# Altium schematic sheet 24V.SchDoc
size A4; SheetNumber: 1; SheetTotal: 5
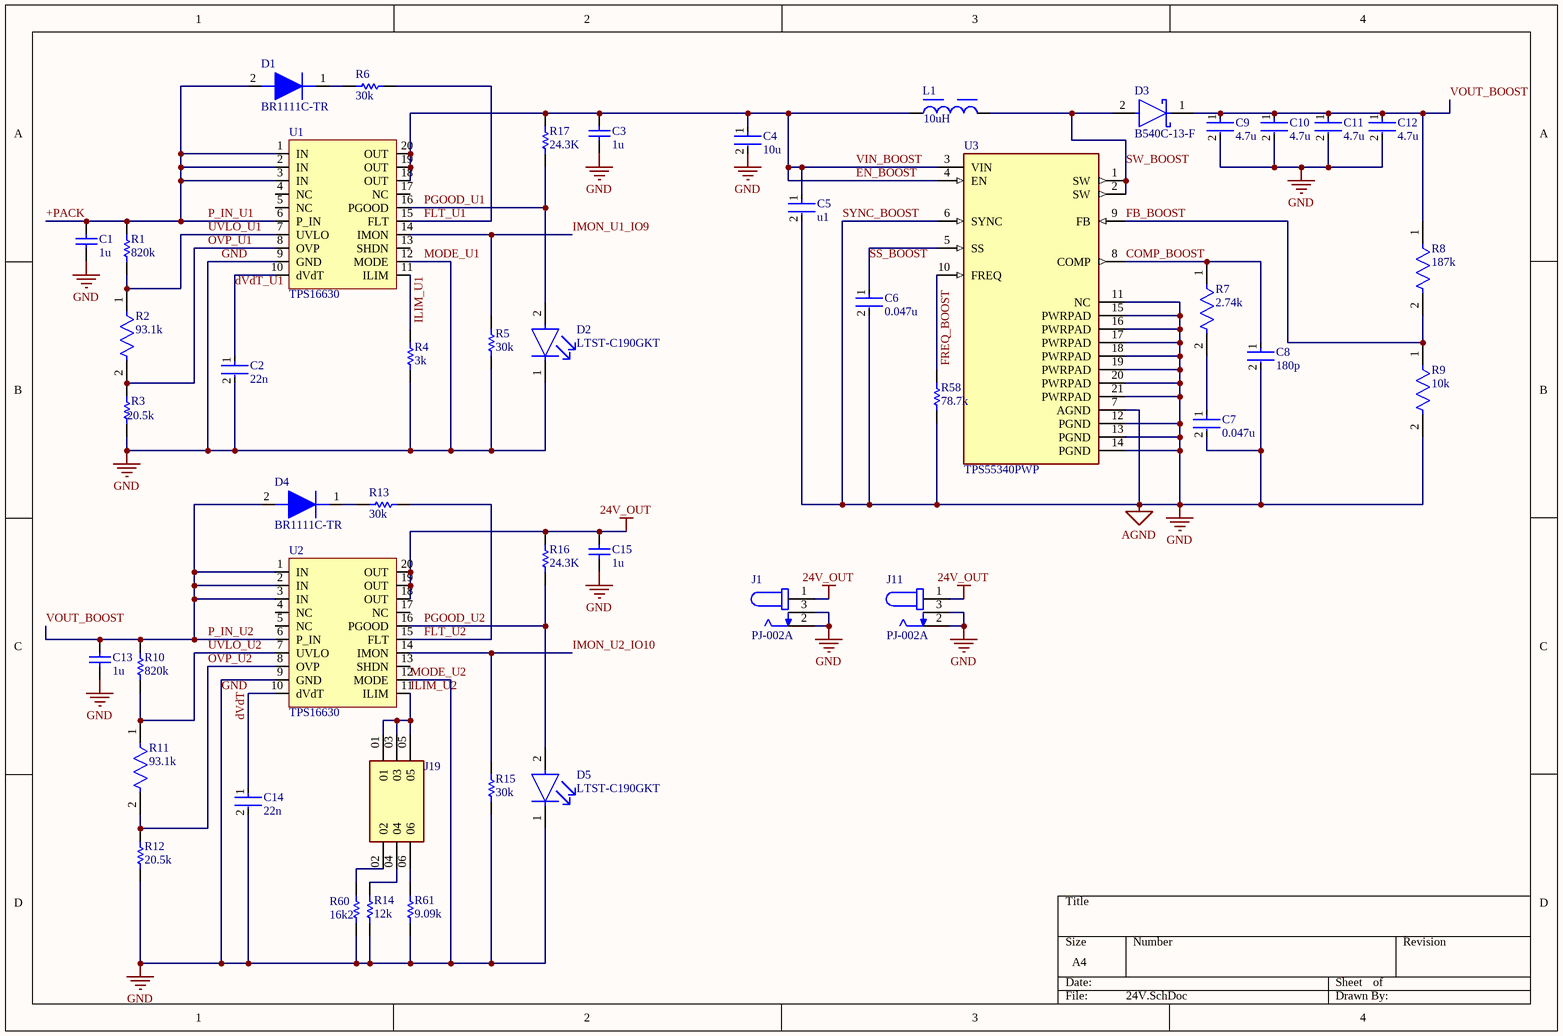
[diagram p0: 24V.SchDoc]

## Parts
C1  1u  [CAPC2013X140X50ML20T25]
C2  22n  [FP-C0603C-CF-MFG]
C3  1u  [CAPC2013X140X50ML20T25]
C4  10u  [FP-GRM21B-0_2-e0_2_0_7-MFG]
C5  u1  [FP-CC0805-0_85-MFG]
C6  0.047u  [FP-C0805C-DN-MFG]
C7  0.047u  [FP-C0805C-DN-MFG]
C8  180p  [FP-C0805C-DN-MFG]
C9  4.7u  [FP-GRM32-MFG]
C10  4.7u  [FP-GRM32-MFG]
C11  4.7u  [FP-GRM32-MFG]
C12  4.7u  [FP-GRM32-MFG]
C13  1u  [CAPC2013X140X50ML20T25]
C14  22n  [FP-C0603C-CF-MFG]
C15  1u  [CAPC2013X140X50ML20T25]
D1  BR1111C-TR  [LED_APHD1608LVBC/D]
D2  LTST-C190GKT  [FP-LTST-C190GKT-MFG]
D3  B540C-13-F  [FP-SMC-MFG]
D4  BR1111C-TR  [LED_APHD1608LVBC/D]
D5  LTST-C190GKT  [FP-LTST-C190GKT-MFG]
J1  PJ-002A  [CUI_PJ-002A]
J11  PJ-002A  [CUI_PJ-002A]
J19  MTSW-103-10-T-D-470  [SAMTEC_MTSW-103-10-T-D-470]  (value not drawn)
L1  10uH  [WE-LHMI_1040]
R1  820k  [RESC1608X55X30ML15T15]
R2  93.1k  [FP-CR0805-IPC_B]
R3  20.5k  [RESC2013X60X40LL20T25]
R4  3k  [RESC2013X70X40NL20T20]
R5  30k  [RESC1609X50X30ML10T20]
R6  30k  [RESC1609X50X30ML10T20]
R7  2.74k  [FP-CR0805-IPC_A]
R8  187k  [FP-ERJ3EK-MFG]
R9  10k  [FP-ERA3A-IPC_C]
R10  820k  [RESC1608X55X30ML15T15]
R11  93.1k  [FP-CR0805-IPC_B]
R12  20.5k  [RESC2013X60X40LL20T25]
R13  30k  [RESC1609X50X30ML10T20]
R14  12k  [RESC2013X70X40ML20T20]
R15  30k  [RESC1609X50X30ML10T20]
R16  24.3K  [RESC1609X50X30NL10T20]
R17  24.3K  [RESC1609X50X30NL10T20]
R58  78.7k  [RESC1608X55X30ML15T15]
R60  16k2  [RESC2013X50X30NL20T20]
R61  9.09k  [RESC2013X60X35ML10T20]
U1  TPS16630  [SOP65P640X110-21N]
U2  TPS16630  [SOP65P640X110-21N]
U3  TPS55340PWP  [IC_TPS55340PWP]

## Nets
24V_OUT: C15.2 J1.1 J11.1 R16.2 U2.18(OUT) U2.19(OUT) U2.20(OUT)
GND: C1.1 C2.2 C3.1 C4.2 C5.2 C6.2 C7.2 C8.2 C9.2 C10.2 C11.2 C12.2 C13.1 C14.2 C15.1 D2.1(C) D5.1(C) J1.2 J1.3 J11.2 J11.3 R3.1 R4.1 R5.1 R9.2 R12.1 R14.1 R15.1 R58.1 R60.1 R61.1 U1.9(GND) U1.12(MODE) U2.9(GND) U2.12(MODE) U3.6(SYNC) U3.7(AGND) U3.11(NC) U3.12(PGND) U3.13(PGND) U3.14(PGND) U3.15(PWRPAD) U3.16(PWRPAD) U3.17(PWRPAD) U3.18(PWRPAD) U3.19(PWRPAD) U3.20(PWRPAD) U3.21(PWRPAD)  [also labelled AGND, MODE_U1, MODE_U2, SYNC_BOOST]
+PACK: C1.2 D1.2 R1.2 U1.1(IN) U1.2(IN) U1.3(IN) U1.6(P_IN)  [also labelled P_IN_U1]
COMP_BOOST: C8.1 R7.1 U3.8(COMP)
dVdT: C14.1 U2.10(dVdT)
dVdT_U1: C2.1 U1.10(dVdT)
EN_BOOST: C3.2 C4.1 C5.1 L1.1 R17.2 U1.18(OUT) U1.19(OUT) U1.20(OUT) U3.3(VIN) U3.4(EN)  [also labelled VIN_BOOST]
FB_BOOST: R8.2 R9.1 U3.9(FB)
FLT_U1: R6.1 U1.15(FLT)
FLT_U2: R13.2 U2.15(FLT)
FREQ_BOOST: R58.2 U3.10(FREQ)
ILIM_U1: R4.2 U1.11(ILIM)
ILIM_U2: J19.01 J19.03 J19.05 U2.11(ILIM)
IMON_U1_IO9: R5.2 U1.14(IMON)
IMON_U2_IO10: R15.2 U2.14(IMON)
OVP_U1: R2.2 R3.2 U1.8(OVP)
OVP_U2: R11.2 R12.2 U2.8(OVP)
P_IN_U2: C9.1 C10.1 C11.1 C12.1 C13.2 D3.1(C) D4.2 R8.1 R10.2 U2.1(IN) U2.2(IN) U2.3(IN) U2.6(P_IN)  [also labelled VOUT_BOOST]
PGOOD_U1: D2.2(A) R17.1 U1.16(PGOOD)
PGOOD_U2: D5.2(A) R16.1 U2.16(PGOOD)
SS_BOOST: C6.1 U3.5(SS)
SW_BOOST: D3.2(A) L1.2 U3.1(SW) U3.2(SW)
UVLO_U1: R1.1 R2.1 U1.7(UVLO)
UVLO_U2: R10.1 R11.1 U2.7(UVLO)
NetC7_1: C7.1 R7.2
NetD1_1: D1.1 R6.2
NetD4_1: D4.1 R13.1
NetJ19_02: J19.02 R60.2
NetJ19_04: J19.04 R14.2
NetJ19_06: J19.06 R61.2

Not connected (* = marked no-connect by the designer): U1 4(NC) 5(NC) 13(SHDN) 17(NC); U2 4(NC) 5(NC) 13(SHDN) 17(NC)

## Library data of the parts
C1 C3 C13 C15 = CMP-2007-03236-1: Manufacturer: Kemet; Part Number: C0805C105K5RACTU
C2 C14 = CMP-2006-03139-2: Ceramic Capacitor 0.022Uf 16V, X7R, 10%, 0603, Full Reel; Manufacturer Part Number: C0603C223K4RACTU; Manufacturer: KEMET; Capacitance: 22,000 pF; Temperature Coefficient: 30ppm/°C; Automotive Grade: Grade 1; Value: 22,000 pF; Tolerance: 0.1; Category: Cap; RoHS: TRUE; Temperature Range High: +125°C; Octopart: https://octopart.com/c0603c223k4ractu-kemet-123286; Mouser Description: CAP CER 0.022UF 16V X7R 0603; Voltage Rating: 16 V; Device Class L1: Passive Components; Automotive: Yes; Height: 0.87mm; Device Class L3: Ceramic Capacitors; Package: C0603C-CF; Temperature Characteristic: X7R; Device Class L2: Capacitors; Material: Ceramic; Lead Free: Yes; ComponentLink2URL: https://api.kemet.com/component-edge/download/datasheet/C0603C100J5GACAUTO.pdf; Temperature Range Low: -55°C; Digikey Description: Ceramic Capacitor 0.022Uf 16V, X7R, 10%, 0603, Full Reel; Temperature: -55°C to +125°C; ComponentLink2Description: Datasheet
C4 = CMP-06035-044754-1: GRM21BR61H106ME43L                       Chip Multilayer Ceramic Capacitors for General Purpose, 0805, 10uF, X5R, 15%, 20%, 50V
C5 = CMP-2100-03606-3: CC0805KRX7R9BB104 CAP CER 0.1UF 50V X7R 0805; Manufacturer: Yageo; Tolerance: 0.1; Capacitance: 100 nF; Value: 100 nF; Material: Ceramic; Device Class L1: Passive Components; ComponentLink2Description: Datasheet; Package: CC0805-0.85; Manufacturer Part Number: CC0805KRX7R9BB104; Digikey Description: CAP CER 0.1UF 50V X7R 0805; Device Class L3: Ceramic Capacitors; Temperature: -30°C to +85°C; Temperature Characteristic: X7R; Voltage Rating: 50 V; Height: 0.95mm; RoHS: TRUE; Ipc Land Pattern Name: CAPC200125X85; Device Class L2: Capacitors; Category: Cap; Temperature Range Low: -30°C; Temperature Range High: +85°C; Mouser Description: Multilayer Ceramic Capacitors MLCC - SMD/SMT 100nF 50V X7R 10%; Footprint Url: http://www.yageo.com/exep/pages/download/literatures/UPY-C_GEN_24.pdf; Automotive: No; Octopart: https://octopart.com/cc0805krx7r9bb104-yageo-192993; Lead Free: Yes; ComponentLink2URL: http://www.yageo.com/documents/recent/UPY-GPHC_Y5V_6.3V-to-50V_8.pdf
C6 C7 = CMP-2007-01098-2: C0805C473K5RACTU  CAP CER 0.047UF 50V X7R 0805; Manufacturer: KEMET; Value: 47,000 pF; Material: Ceramic; Tolerance: 0.1; Description: C0805 47,000 pF X7R 30ppm/°C 10.00% 50 V; Temperature Coefficient: 30ppm/°C; Ipc Land Pattern Name: CAPC200125X78; ComponentLink2URL: https://content.kemet.com/datasheets/KEM_C1003_C0G_SMD.pdf; Manufacturer Part Number: C0805C473K5RACTU; ComponentLink2Description: Datasheet; Voltage Rating: 50 V; Device Class L3: Ceramic Capacitors; Temperature Range High: +125°C; Temperature: -55°C to +125°C; RoHS: TRUE; Capacitance: 47,000 pF; Digikey Description: CAP CER 0.047UF 50V X7R 0805; Octopart: https://octopart.com/c0805c473k5ractu-kemet-138387; Temperature Range Low: -55°C; Height: 0.88mm; Lead Free: Yes; Temperature Characteristic: X7R; Mouser Description: Capacitor; Ceramic; Cap 0.047 uF; Tol 10%; Vol-Rtg 50 VDC; SMT; 0805; X7R; Tape&Reel; Automotive: No; Device Class L1: Passive Components; Device Class L2: Capacitors; Package: C0805C-DN; Category: Cap
C8 = CMP-2007-00307-2: CAP CER 180PF 50V C0G/NP0 0805; Manufacturer: KEMET; Manufacturer Part Number: C0805C181J5GACTU; Temperature Characteristic: C0G; Temperature Coefficient: 30ppm/°C; Tolerance: 0.05; Material: Ceramic; ComponentLink2Description: Datasheet; Automotive: No; Value: 180 pF; Temperature Range High: +125°C; Digikey Description: CAP CER 180PF 50V C0G/NP0 0805; Octopart: https://octopart.com/c0805c181j5gactu-kemet-108653; Device Class L2: Capacitors; ComponentLink2URL: https://content.kemet.com/datasheets/KEM_C1003_C0G_SMD.pdf; RoHS: TRUE; Device Class L3: Ceramic Capacitors; Voltage Rating: 50 V; Lead Free: Yes; Package: C0805C-DN; Temperature Range Low: -55°C; Capacitance: 180 pF; Ipc Land Pattern Name: CAPC200125X78; Mouser Description: Multilayer Ceramic Capacitors MLCC - SMD/SMT 50volts 180pF C0G 5%; Temperature: -55°C to +125°C; Category: Cap; Height: 0.88mm; Device Class L1: Passive Components
C9-C12 = CMP-1038-02162-3: CAP CER 4.7UF 50V X7R 1210; Manufacturer: Murata; Manufacturer Part Number: GRM32ER71H475KA88L; Tolerance: 10%; Temperature Coefficient: 15%; Material: Ceramic; Lead Free: Yes; Value: 4.7uF; ComponentLink2Description: Datasheet; Capacitance: 4.7uF; Digikey Description: CAP CER 4.7UF 50V X7R 1210; Category: Cap; Automotive: No; ComponentLink2URL: https://search.murata.co.jp/Ceramy/image/img/A01X/G101/ENG/GRM32ER71H475KA88-01A.pdf; Package: GRM32; Device Class L2: Capacitors; Voltage Rating: 50V; Device Class L1: Passive Components; Mouser Description: Capacitor Capacitance tolerance: ±10% Ceramic type: X7R Construction form: 1210 Capacitance: 4.7 µF Rated voltage: 50...; Octopart: https://octopart.com/grm32er71h475ka88l-murata-196576; Temperature: -55°C to +125°C; Temperature Range Low: -55°C; Height: 2.7mm; Temperature Characteristic: X7R; Temperature Range High: +125°C; RoHS: TRUE; Device Class L3: Ceramic Capacitors
D2 D5 = CMP-22017-000005-2: LED GREEN CLEAR CHIP SMD; Dominant Wavelength: 569nm; Reverse Voltage: 5V; Lens Color: Colorless; Viewing Angle: 130°; Voltage: 2V; Forward Current: 30mA; Power Dissipation: 100mW; Luminous Intensity: 6mcd; Number of LEDs: 1; Forward Voltage: 2.1V; Wavelength: 565nm; Test Current: 10mA; Min Operating Temperature: -55°C; Lens Style: Clear; Mount: Surface Mount; Width: 0.8mm; Packaging: Tape and Reel; Lens Transparency: Clear; Case Code (Metric): 1608; Depth: 0.8mm; Case Code (Imperial): 0603; Case/Package: 0603; Number of Pins: 2; Max Operating Temperature: 85°C; Lead Free: Lead Free; Number of Elements: 1; Length: 1.6mm; Height: 0.8mm; Package Quantity: 1; Power Rating: 100mW; Radiation Hardening: No; Illumination Color: Green; Color: Green
D3 = CMP-2000-05097-3: DIODE SCHOTTKY 40V 5A SMC; Manufacturer: Diodes Inc.; Automotive Grade: NA; Peak Reverse Current: 0.5mA; Value: 300pF; Max Junction Temp: +150°C; Max Surge Forward Current: 100A; Standoff Height: 0.1mm; Digikey Description: DIODE SCHOTTKY 40V 5A SMC; Temperature Range Low: -55°C; Manufacturer Part Number: B540C-13-F; Octopart: https://octopart.com/b540c-13-f-diodes+inc.-325873; Lead Free: Yes; Reverse Voltage: 40V; RoHS: TRUE; Category: Diode; Mouser Description: Diode: Schottky rectifying; SMD; 40V; 5A; SMC; Package: reel, tape; ComponentLink2Description: Datasheet; Temperature Range High: +150°C; Automotive: No; Footprint Url: https://www.diodes.com/assets/Package-Files/SMC.pdf; Device Class L3: Schottky Diodes; Height: 2.5mm; Forward Current: 5A; Temperature: -55°C to +150°C; Package: SMC; ComponentLink2URL: https://www.diodes.com/assets/Datasheets/ds13012.pdf; Device Class L2: Diodes; Max Repetitive Reverse Voltage: 40V; Device Class L1: Discrete Semiconductors; Capacitance: 300pF
J1 J11 = PJ-002A: 2.0 x 6.5 mm, 2.5 A, Horizontal, Through Hole, Dc Power Jack Connector; MF: CUI Devices; MP: PJ-002A; Check_prices: https://www.snapeda.com/parts/PJ-002A/CUI+Devices/view-part/?ref=eda; Availability: In Stock; CUI_purchase_URL: https://www.cuidevices.com/product/interconnect/connectors/dc-power-connectors/jacks/pj-002a?utm_source=snapeda.com&utm_medium=referral&utm_campaign=snapedaBOM; SnapEDA_Link: https://www.snapeda.com/parts/PJ-002A/CUI+Devices/view-part/?ref=snap; Purchase-URL: https://pricing.snapeda.com/search/part/PJ-002A/?ref=eda; Price: None; Package: None; Value: *
L1 = CMP-1353-00006-5: NexarPartId: 22866671; Core Material: Composite, Ferrite; Series Resistance: 30mΩ; Test Frequency: 100kHz; Self Resonant Frequency: 12MHz; Max DC Current: 5.2A; Inductance Tolerance: 20%; Inductance: 10µH; Shielding: Shielded; DC Resistance (DCR): 27mΩ; Saturation Current: 7.9A; Width: 10mm; Min Operating Temperature: -40°C; Height: 3.8mm; RoHS: Compliant; Depth: 10mm; Mount: Surface Mount; Case/Package: Nonstandard; Height - Seated (Max): 3.9878mm; Packaging: Digi-Reel®; Tolerance: 20%; REACH SVHC: Unknown; Max Operating Temperature: 125°C; Ambient Temperature Range Low: -40°C; Ambient Temperature Range High: 85°C; Length: 11mm; Composition: Wirewound; Termination: SMD/SMT; RMS Current (Irms): 5.2A; Current Rating: 5.2A; Frequency: 12MHz
R1 R10 = CMP-2000-00657-1: Manufacturer: Panasonic; Part Number: ERJ3EKF8203V
R2 R11 = CMP-07231-005357-1: Thick Film Chip Resistors 0805 93.1kΩ 0.125W 1% 100ppm/°C; Resistance: 93.1kR; Voltage Rating: 150V; Power Rating: 125mW; Number of Terminations: 2; Max Operating Temperature: 155°C; Tolerance: 1%; Width: 0.049inch; Termination: SMD/SMT; Case Code (Imperial): 0805; Mount: Surface Mount; Depth: 1.25mm; Case Code (Metric): 2012; Package Quantity: 5000; Case/Package: 0805; Composition: Thick Film; Thickness: 508um; Military Standard: Not; Contact Plating: Tin; Temperature Coefficient: 100ppm/°C; Features: Moisture Resistant; Height: 0.024inch; Length: 2mm; Min Operating Temperature: -55°C; Radiation Hardening: No; Max Power Dissipation: 125mW; Packaging: Tape and Reel
R3 R12 = CMP-2001-00767-1: Manufacturer: Panasonic; Part Number: ERA6AEB2052V
R4 = CMP-2001-00395-1: ERJ-6GEYJ302V; Manufacturer: Panasonic; Part Number: ERJ-6GEYJ302V
R5 R6 R13 R15 = CMP-2000-03224-1: Manufacturer: Vishay Dale; Part Number: CRCW060330K0JNEA
R7 = CMP-07231-003311-1: Thick Film Chip Resistors 0805 2.74kΩ 0.125W 1% 100ppm/°C; Voltage Rating: 150V; Power Rating: 125mW; Resistance: 2.74kR; Case/Package: 0805; Package Quantity: 5000; Tolerance: 1%; Thickness: 508um; Mount: Surface Mount; Width: 1.25mm; Depth: 1.25mm; Radiation Hardening: No; Case Code (Metric): 2012; Termination: SMD/SMT; Composition: Thick Film; Length: 2mm; Temperature Coefficient: 100ppm/°C; Contact Plating: Tin; Case Code (Imperial): 0805; Features: Moisture Resistant; Height: 0.024inch; Min Operating Temperature: -55°C; Packaging: Tape and Reel; Max Operating Temperature: 155°C; Military Standard: Not; Max Power Dissipation: 125mW; Number of Terminations: 2
R8 = CMP-2000-00305-2: RES SMD 187K OHM 1% 1/10W 0603; Temperature Coefficient: 100ppm/°C; Max Power Dissipation: 100mW; Voltage Rating (DC): 50V; Resistance: 187kR; Voltage Rating: 75V; Packaging: Tape and Reel; Height: 0.45mm; Mount: Surface Mount; Min Operating Temperature: -55°C; Contact Plating: Tin; Radiation Hardening: No; Case/Package: 0603; Technology: THICK FILM; Resistor Type: Thick Film; Features: Automotive AEC-Q200; Length: 1.6mm; REACH SVHC: Yes; Construction: Rectangular; Max Operating Temperature: 155°C; Military Standard: Not; Case Code (Imperial): 0603; RoHS Compliant: Yes; Package Quantity: 1; Power Rating: 100mW; Termination: SMD/SMT; Resistance Tolerance: 1%; Number of Terminations: 2; Case Code (Metric): 1608; Depth: 0.8mm; Series: ERJ; Tolerance: 1%; Width: 0.8mm; Lead Free: Lead Free
R9 = CMP-2000-00874-2: RES SMD 10K OHM 0.1% 1/10W 0603; Voltage Rating (DC): 75V; Power Rating: 100mW; Resistance: 10kR; Temperature Coefficient: 25ppm/°C; Radiation Hardening: No; Width: 0.8mm; Depth: 0.8mm; Construction: Rectangular; Case Code (Metric): 1608; Package Quantity: 5000; Length: 1.6mm; Size Code: 0603; Case Code (Imperial): 0603; Termination: SMD/SMT; Contact Plating: Tin; Resistance Tolerance: 0.1%; Military Standard: Not; Packaging: Tape and Reel; Max Power Dissipation: 100mW; REACH SVHC: No SVHC; Series: ERA-3A; Voltage Rating: 75V; Lead Free: Lead Free; Technology: METAL FILM; RoHS Compliant: Yes; Max Operating Temperature: 155°C; Resistor Type: Thin Film; Min Operating Temperature: -55°C; Number of Pins: 2; Case/Package: 0603; Tolerance: 0.1%; Height: 0.45mm; Mount: Surface Mount; Number of Terminations: 2
R14 = CMP-2001-00513-1: Manufacturer: Panasonic; Part Number: ERJ6ENF1202V
R16 R17 = CMP-2000-03120-1: Part Number: CRCW060324K3FKEA; Manufacturer: Vishay Dale
R58 = CMP-2000-00646-1: Part Number: ERJ-3EKF7872V; Manufacturer: Panasonic
R60 = CMP-1013-00645-2: CRCW080516K2FKEA; Manufacturer: Vishay Dale; Part Number: CRCW080516K2FKEA
R61 = CMP-2001-01318-2: RC0805FR-079K09L Chip Resistor, 9.09 KOhm, +/- 1%, 0.125 W, -55 to 155 degC, 0805 (2012 Metric), RoHS, Tape and Reel; Case\Package: 0805; Voltage Rating: 150 V; Power Rating: 125 mW; Width: 1.25 mm; Height: 0.5 mm; Packaging: Tape and Reel; Case Code (Imperial): 0805; RoHSCompliant: true; ComponentLink1URL: http://www.yageo.com/; ComponentLink2Description: Datasheet; Case Code (Metric): 2012; Max Operating Temperature: 155 degC; PackageReference: 0805; DatasheetVersion: Rev. 4, 02/2016; ComponentLink2URL: http://www.yageo.com/documents/recent/PYu-RC_Group_51_RoHS_L_04.pdf; Length: 2 mm; Package Quantity: 5000; Min Operating Temperature: -55 degC; Mounting Technology: Surface Mount; Resistance: 9.09 kohm; ComponentLink1Description: Manufacturer URL; PackageDescription: 2-Pin Surface Mounted Device, Body 2 x 1.25 mm; Tolerance: 1%
U3 = TPS55340PWP: Integrated, 5-A 40-V Wide Input Range Boost/SEPIC/Flyback DC-DC Regulator 14-HTSSOP -40 to 150; MF: Texas Instruments; Check_prices: https://www.snapeda.com/parts/TPS55340PWP/Texas+Instruments/view-part/?ref=eda; Price: None; SnapEDA_Link: https://www.snapeda.com/parts/TPS55340PWP/Texas+Instruments/view-part/?ref=snap; MP: TPS55340PWP; Value: *; Availability: In Stock; Package: HTSSOP-14 Texas Instruments; Purchase-URL: https://pricing.snapeda.com/search/part/TPS55340PWP/?ref=eda; Supplier 1: Digikey; Supplier Part Number 1: 296-35493-5-ND; Supplier 2: Mouser; Supplier Part Number 2: 595-TPS55340PWP
J19 = MTSW-103-10-T-D-470: Package: None; Price: None; Value: *; MP: MTSW-103-10-T-D-470; Availability: Unavailable